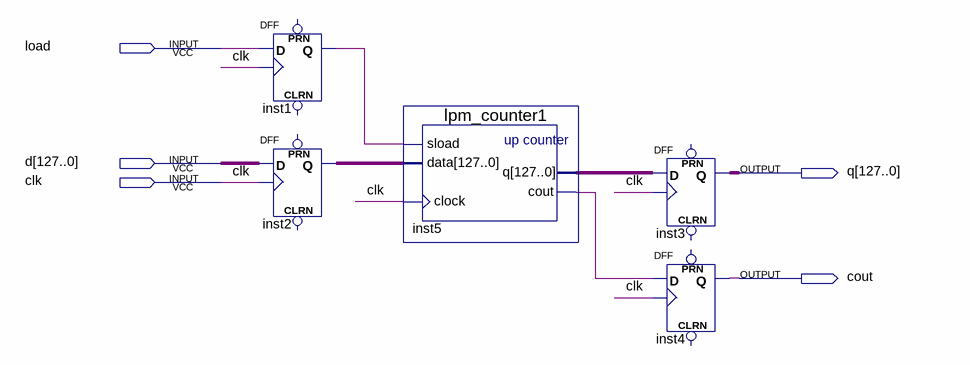
[diagram p0: schematic sheet]
// Quartus schematic lab3_128.bdf as structural Verilog: 5 symbols, 5 pins
module lab3_128 (
  input  load,
  input  [127:0] d,
  input  clk,
  output [127:0] q,
  output cout
);

  wire inst1_q, inst5_cout;
  wire [127:0] inst2_q, inst5_q;

  DFF inst1 (.CLK(clk), .D(load), .Q(inst1_q));  // open: CLRN, PRN
  DFF inst2[127:0] (.CLK(clk), .D(d), .Q(inst2_q));  // open: CLRN, PRN
  lpm_counter1 inst5 (.sload(inst1_q), .data(inst2_q), .clock(clk), .cout(inst5_cout), .q(inst5_q));
  DFF inst3[127:0] (.CLK(clk), .D(inst5_q), .Q(q));  // open: CLRN, PRN
  DFF inst4 (.CLK(clk), .D(inst5_cout), .Q(cout));  // open: CLRN, PRN
endmodule
